# EAGLE design input_stage (EAGLE 7.6.0)
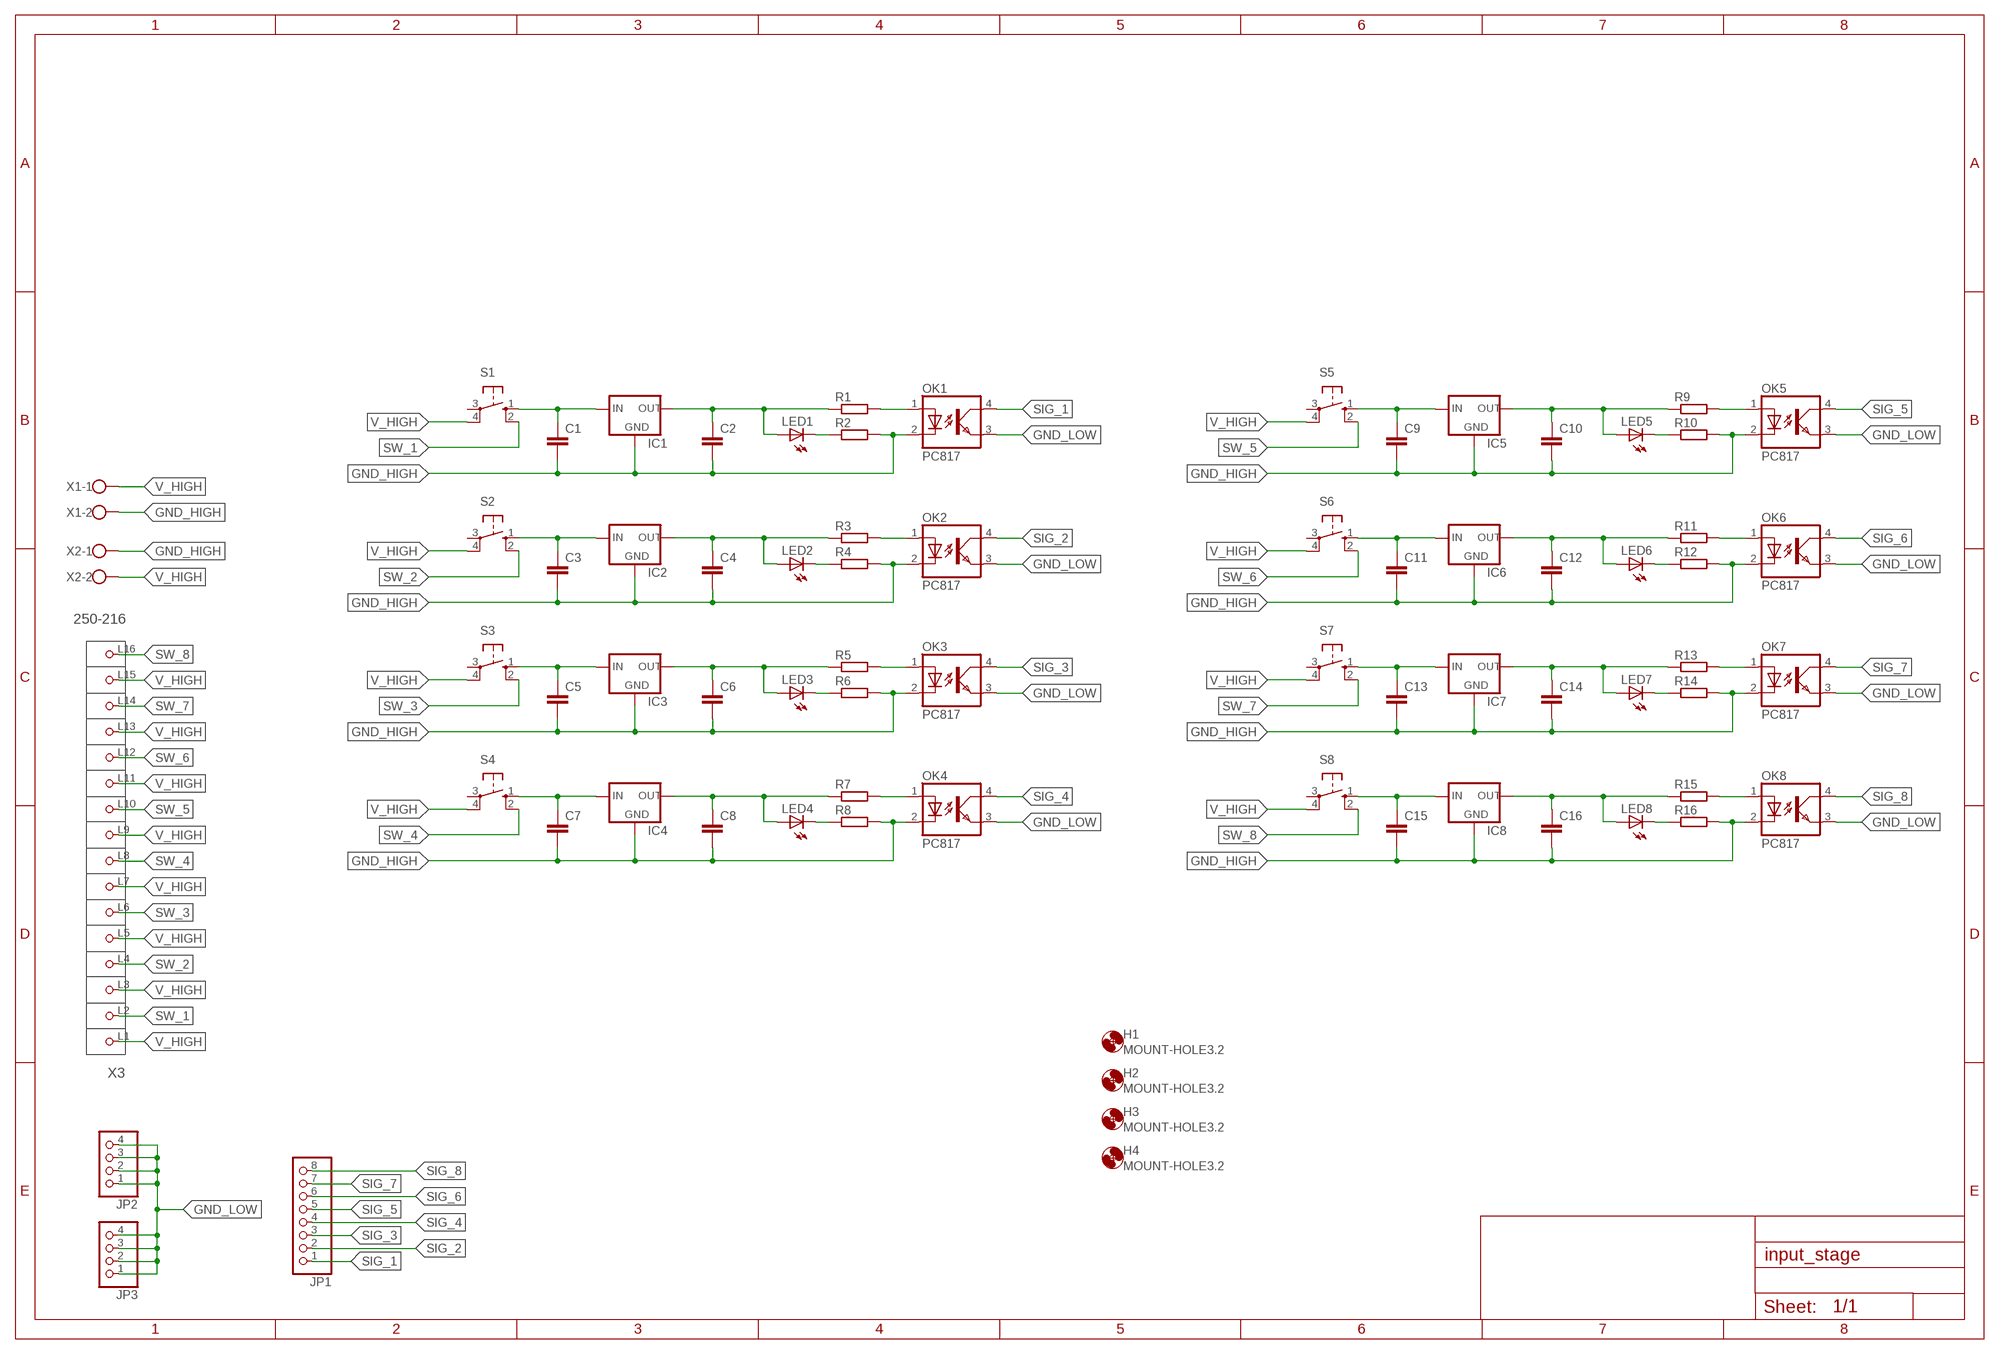
[diagram p0: schematic, sheet 1]

## Parts
C1  C-EU050-024X044  [C050-024X044]
C2  C-EU050-024X044  [C050-024X044]
C3  C-EU050-024X044  [C050-024X044]
C4  C-EU050-024X044  [C050-024X044]
C5  C-EU050-024X044  [C050-024X044]
C6  C-EU050-024X044  [C050-024X044]
C7  C-EU050-024X044  [C050-024X044]
C8  C-EU050-024X044  [C050-024X044]
C9  C-EU050-024X044  [C050-024X044]
C10  C-EU050-024X044  [C050-024X044]
C11  C-EU050-024X044  [C050-024X044]
C12  C-EU050-024X044  [C050-024X044]
C13  C-EU050-024X044  [C050-024X044]
C14  C-EU050-024X044  [C050-024X044]
C15  C-EU050-024X044  [C050-024X044]
C16  C-EU050-024X044  [C050-024X044]
H1  MOUNT-HOLE3.2  [3,2]
H2  MOUNT-HOLE3.2  [3,2]
H3  MOUNT-HOLE3.2  [3,2]
H4  MOUNT-HOLE3.2  [3,2]
IC1  78LXX  [78LXX]
IC2  78LXX  [78LXX]
IC3  78LXX  [78LXX]
IC4  78LXX  [78LXX]
IC5  78LXX  [78LXX]
IC6  78LXX  [78LXX]
IC7  78LXX  [78LXX]
IC8  78LXX  [78LXX]
JP1  PINHD-1X8  [1X08]
JP2  PINHD-1X4  [1X04]
JP3  PINHD-1X4  [1X04]
LED1  LED3MM  [LED3MM]
LED2  LED3MM  [LED3MM]
LED3  LED3MM  [LED3MM]
LED4  LED3MM  [LED3MM]
LED5  LED3MM  [LED3MM]
LED6  LED3MM  [LED3MM]
LED7  LED3MM  [LED3MM]
LED8  LED3MM  [LED3MM]
OK1  PC817  [DIL04]
OK2  PC817  [DIL04]
OK3  PC817  [DIL04]
OK4  PC817  [DIL04]
OK5  PC817  [DIL04]
OK6  PC817  [DIL04]
OK7  PC817  [DIL04]
OK8  PC817  [DIL04]
R1  R-EU_0207/10  [0207/10]
R2  R-EU_0207/10  [0207/10]
R3  R-EU_0207/10  [0207/10]
R4  R-EU_0207/10  [0207/10]
R5  R-EU_0207/10  [0207/10]
R6  R-EU_0207/10  [0207/10]
R7  R-EU_0207/10  [0207/10]
R8  R-EU_0207/10  [0207/10]
R9  R-EU_0207/10  [0207/10]
R10  R-EU_0207/10  [0207/10]
R11  R-EU_0207/10  [0207/10]
R12  R-EU_0207/10  [0207/10]
R13  R-EU_0207/10  [0207/10]
R14  R-EU_0207/10  [0207/10]
R15  R-EU_0207/10  [0207/10]
R16  R-EU_0207/10  [0207/10]
S1  10-XX  [B3F-10XX]
S2  10-XX  [B3F-10XX]
S3  10-XX  [B3F-10XX]
S4  10-XX  [B3F-10XX]
S5  10-XX  [B3F-10XX]
S6  10-XX  [B3F-10XX]
S7  10-XX  [B3F-10XX]
S8  10-XX  [B3F-10XX]
X1  W237-102  [W237-102]
X2  W237-102  [W237-102]
X3  250-216  [P-250-216]

## Nets
GND_HIGH: C1.2 C2.2 C3.2 C4.2 C5.2 C6.2 C7.2 C8.2 C9.2 C10.2 C11.2 C12.2 C13.2 C14.2 C15.2 C16.2 IC1.GND IC2.GND IC3.GND IC4.GND IC5.GND IC6.GND IC7.GND IC8.GND OK1.2(C) OK2.2(C) OK3.2(C) OK4.2(C) OK5.2(C) OK6.2(C) OK7.2(C) OK8.2(C) R2.2 R4.2 R6.2 R8.2 R10.2 R12.2 R14.2 R16.2 X1.2 X2.1
GND_LOW: JP2.1 JP2.2 JP2.3 JP2.4 JP3.1 JP3.2 JP3.3 JP3.4 OK1.3(EMIT) OK2.3(EMIT) OK3.3(EMIT) OK4.3(EMIT) OK5.3(EMIT) OK6.3(EMIT) OK7.3(EMIT) OK8.3(EMIT)
N$1: OK1.1(A) R1.2
N$2: C2.1 IC1.OUT LED1.A R1.1
N$3: C1.1 IC1.IN S1.1(S)
N$4: LED1.K(C) R2.1
N$5: OK4.1(A) R7.2
N$6: OK2.1(A) R3.2
N$7: C8.1 IC4.OUT LED4.A R7.1
N$8: LED4.K(C) R8.1
N$9: OK5.1(A) R9.2
N$10: C10.1 IC5.OUT LED5.A R9.1
N$11: LED5.K(C) R10.1
N$12: OK6.1(A) R11.2
N$13: C3.1 IC2.IN S2.1(S)
N$14: C12.1 IC6.OUT LED6.A R11.1
N$15: C5.1 IC3.IN S3.1(S)
N$16: LED6.K(C) R12.1
N$17: C7.1 IC4.IN S4.1(S)
N$18: OK7.1(A) R13.2
N$19: C15.1 IC8.IN S8.1(S)
N$20: C4.1 IC2.OUT LED2.A R3.1
N$21: LED2.K(C) R4.1
N$22: C14.1 IC7.OUT LED7.A R13.1
N$23: OK3.1(A) R5.2
N$24: C6.1 IC3.OUT LED3.A R5.1
N$25: LED3.K(C) R6.1
N$26: LED7.K(C) R14.1
N$27: OK8.1(A) R15.2
N$28: C16.1 IC8.OUT LED8.A R15.1
N$29: LED8.K(C) R16.1
N$30: C13.1 IC7.IN S7.1(S)
N$31: C11.1 IC6.IN S6.1(S)
N$32: C9.1 IC5.IN S5.1(S)
SIG_1: JP1.1 OK1.4(COL)
SIG_2: JP1.2 OK2.4(COL)
SIG_3: JP1.3 OK3.4(COL)
SIG_4: JP1.4 OK4.4(COL)
SIG_5: JP1.5 OK5.4(COL)
SIG_6: JP1.6 OK6.4(COL)
SIG_7: JP1.7 OK7.4(COL)
SIG_8: JP1.8 OK8.4(COL)
SW_1: S1.2(S1) X3.L2(P2)
SW_2: S2.2(S1) X3.L4(P4)
SW_3: S3.2(S1) X3.L6(P6)
SW_4: S4.2(S1) X3.L8(P8)
SW_5: S5.2(S1) X3.L10(P10)
SW_6: S6.2(S1) X3.L12(P12)
SW_7: S7.2(S1) X3.L14(P14)
SW_8: S8.2(S1) X3.L16(P16)
V_HIGH: S1.4(P1) S2.4(P1) S3.4(P1) S4.4(P1) S5.4(P1) S6.4(P1) S7.4(P1) S8.4(P1) X1.1 X2.2 X3.L1(P1) X3.L3(P3) X3.L5(P5) X3.L7(P7) X3.L9(P9) X3.L11(P11) X3.L13(P13) X3.L15(P15)
Unconnected: S1.3(P) S2.3(P) S3.3(P) S4.3(P) S5.3(P) S6.3(P) S7.3(P) S8.3(P)

## Library data of the parts
C1-C16 = resistor:C-EU: CAPACITOR, European symbol
H1-H4 = holes:MOUNT-HOLE: MOUNTING HOLE with drill center marker
IC1-IC8 = v-reg:78LXX: VOLTAGE REGULATOR
JP1 = pinhead:PINHD-1X8: PIN HEADER
JP2 JP3 = pinhead:PINHD-1X4: PIN HEADER
LED1-LED8 = led:LED: LED OSRAM: - CHIPLED LG R971, LG N971, LY N971, LG Q971, LY Q971, LO R971, LY R971 LH N974, LH R974 LS Q976, LO Q976, LY Q976 LO Q996 - Hyper CHIPLED LW Q18S LB Q993, LB Q99A, LB R99A - SideLED LS A670, LO A670, LY A670, LG A670, LP A670 LB A673, LV A673, LT A673, LW A673 LH A674 LY A675 LS A676, LA A676, LO A676, LY A676, LW A676 LS A679, LY A679, LG A679 - Hyper Micro SIDELED® LS Y876, LA Y876, LO Y876, LY Y876 LT Y87S - SmartLED LW L88C, LW L88S LB L89C, LB L89S, LG L890 LS L89K, LO L89K, LY L89K LS L896, LA L896, LO L896, LY L896 - TOPLED LS T670, LO T670, LY T670, LG T670, LP T670 LSG T670, LSP T670, LSY T670, LOP T670, LYG T670 LG T671, LOG T671, LSG T671 LB T673, LV T673, LT T673, LW T673 LH T674 LS T676, LA T676, LO T676, LY T676, LB T676, LH T676, LSB T676, LW T676 LB T67C, LV T67C, LT T67C, LS T67K, LO T67K, LY T67K, LW E67C LS E67B, LA E67B, LO E67B, LY E67B, LB E67C, LV E67C, LT E67C LW T67C LS T679, LY T679, LG T679 LS T770, LO T770, LY T770, LG T770, LP T770 LB T773, LV T773, LT T773, LW T773 LH T774 LS E675, LA E675, LY E675, LS T675 LS T776, LA T776, LO T776, LY T776, LB T776 LHGB T686 LT T68C, LB T68C - Hyper Mini TOPLED® LB M676 - Mini TOPLED Santana® LG M470 LS M47K, LO M47K, LY M47K Source: http://www.osram.convergy.de LUXEON: - LUMILED® LXK2-PW12-R00, LXK2-PW12-S00, LXK2-PW14-U00, LXK2-PW14-V00 LXK2-PM12-R00, LXK2-PM12-S00, LXK2-PM14-U00 LXK2-PE12-Q00, LXK2-PE12-R00, LXK2-PE12-S00, LXK2-PE14-T00, LXK2-PE14-U00 LXK2-PB12-K00, LXK2-PB12-L00, LXK2-PB12-M00, LXK2-PB14-N00, LXK2-PB14-P00, LXK2-PB14-Q00 LXK2-PR12-L00, LXK2-PR12-M00, LXK2-PR14-Q00, LXK2-PR14-R00 LXK2-PD12-Q00, LXK2-PD12-R00, LXK2-PD12-S00 LXK2-PH12-R00, LXK2-PH12-S00 LXK2-PL12-P00, LXK2-PL12-Q00, LXK2-PL12-R00 Source: www.luxeon.com KINGBRIGHT: KA-3528ASYC Source: www.kingbright.com
OK1-OK8 = optocoupler:PC817: SHARP OPTO COUPLER; MPN: PC817X4J000F; OC_FARNELL: 9707727; OC_NEWARK: 97K7059
R1-R16 = resistor:R-EU_: RESISTOR, European symbol
S1-S8 = switch-omron:10-XX: OMRON SWITCH; MPN: B3F-1000; OC_FARNELL: 176432; OC_NEWARK: 36M3542
X1 X2 = con-wago-500:W237-102: WAGO SCREW CLAMP; MPN: 237-102; OC_FARNELL: unknown; OC_NEWARK: 70K9898
X3 = con-wago_250:250-216: Serie 250, 1-Leiter-Klemmenleiste für Leiterplatten 1 Lötstift/Pol versetzt / Series 250, 1-conductor PCB terminal strip 1 solder pin/pole, staggered Polzahl / Pole No.: 16 Rastermaß / Pitch: 3.5 - 3.5 mm Bemessungsspannung / Rated Voltage: 320 V Nennstrom / Nominal Current: 8 A Leiterquerschnitt / Conductor Size: 0.2 - 1.5 mm2 Anschlusstechnik / Connection Technology: CAGE CLAMP® S Lötstiftlänge: / Solder Pin Length: 3.6 mm Leitereinführung (zur Platine) / Conductor entry angle (to PCB): 45 ° Farbe / Color: grau / gray Stand: 01.01.2014. Die jeweils aktuellen Daten zu diesem Artikel finden Sie in unserem Produktkatalog, den Sie unter www.wago.com einsehen können. As of: 01/01/2014. Please find the newest data for this article in our product catalogue, which can be viewed under www.wago.com.

## Board
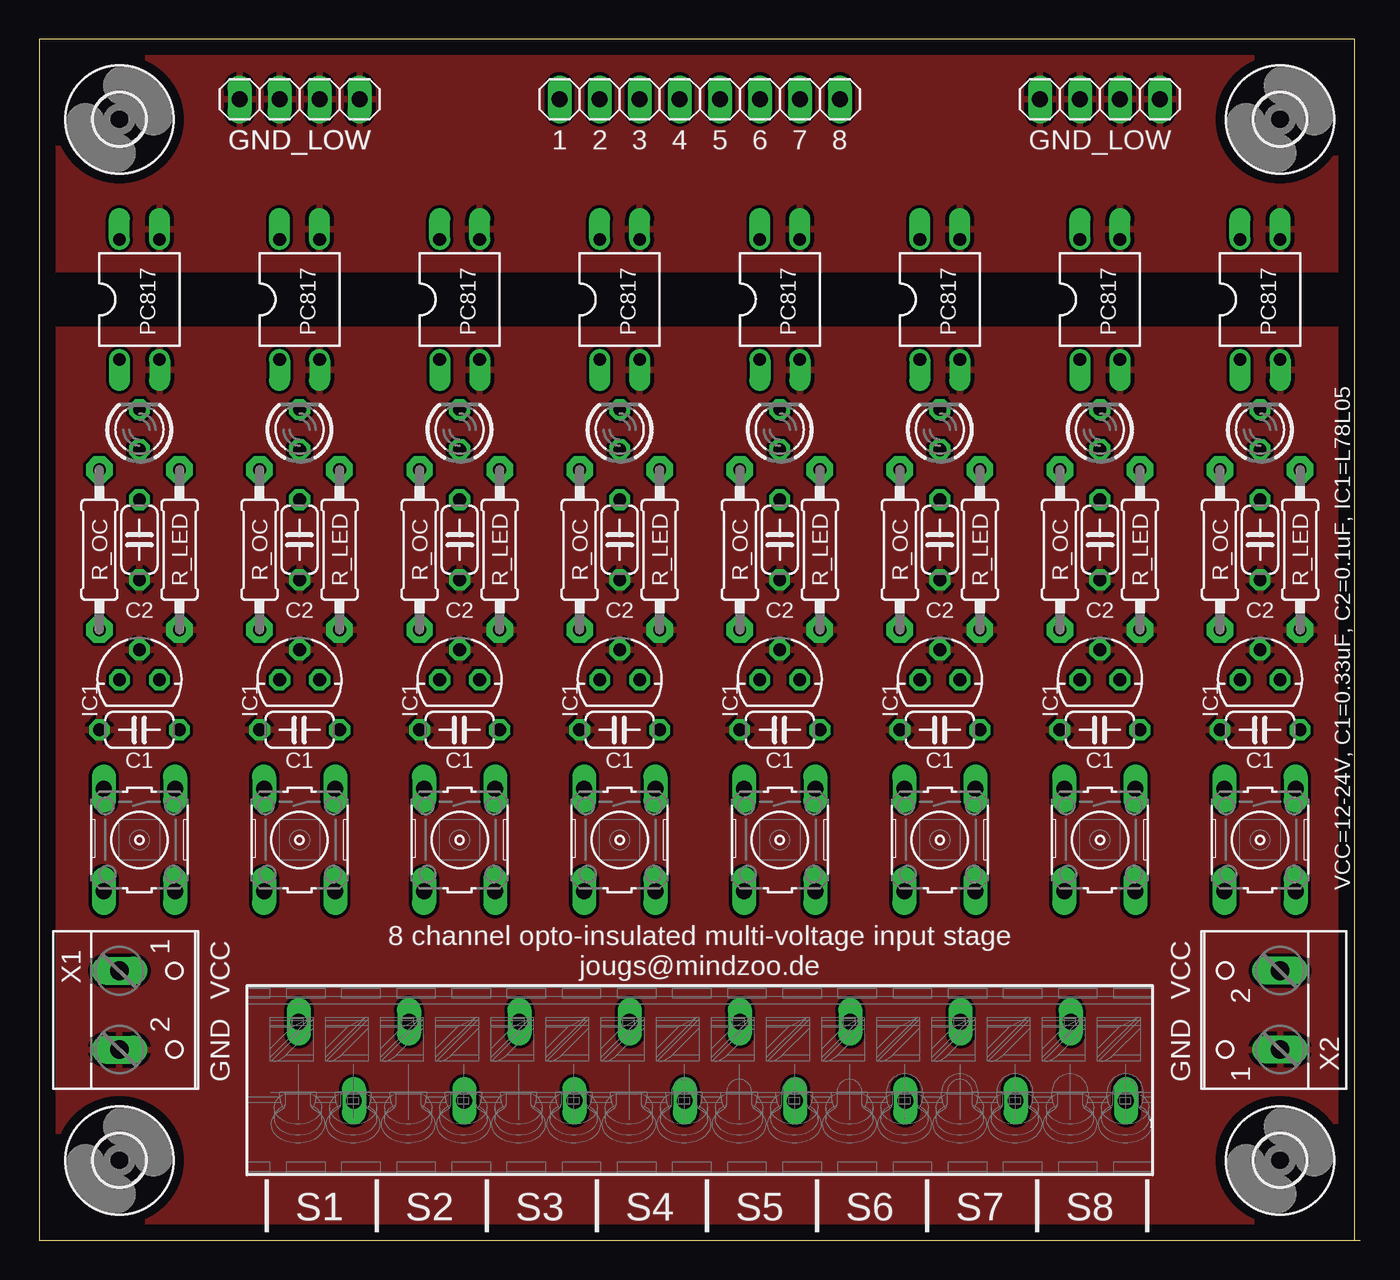
[diagram p1: board, top side]
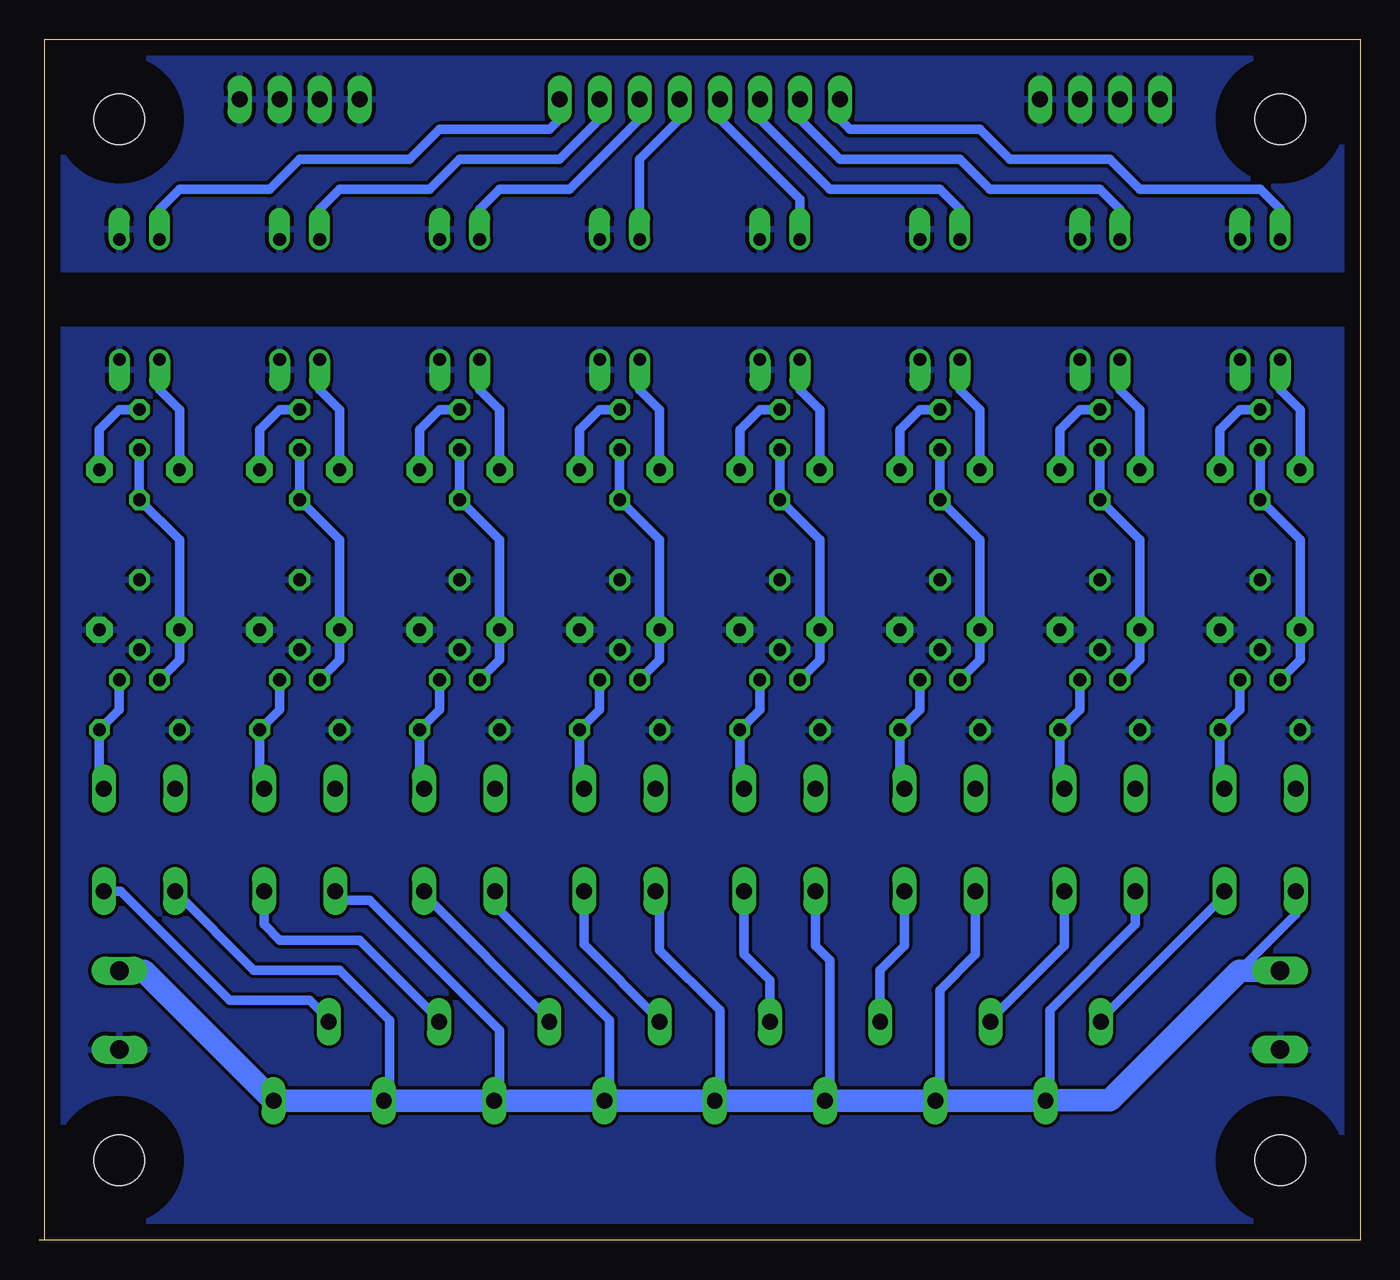
[diagram p2: board, bottom side, seen from below]

Size 83.82 x 76.19 mm. Coordinates in mm from the lower left corner, seen from the top.
Outline: 83.49,0 83.49,76.19 0,76.19 0,0 83.82,0
Copper layers (1*16): Top 0.035mm / dielectric 1.5mm / Bottom 0.035mm
Design rules "default": minimum track width 10mil, minimum drill 24mil, track to track 8mil, track to pad 8mil, pad to pad 8mil, via to via 8mil, smd to smd 8mil, copper to edge 40mil, drill to drill 8mil, minimum pad ring 10mil, minimum via ring 8mil, stop-mask expansion 4mil, vias tented up to drill 0mil, thermal gap 10mil

### Footprints (pad centres in the part's own frame; a part is rotated, then mirrored left to right if it is on the bottom)
C050-024X044 = drill 0.813 octagon: 1 -2.54,0; 2 2.54,0
3,2 = hole 3.2: 0,0
78LXX = drill 0.813 octagon: GND 0,1.905; IN 1.27,0; OUT -1.27,0
1X08 = drill 1.016 long: 1 -8.89,0; 2 -6.35,0; 3 -3.81,0; 4 -1.27,0; 5 1.27,0; 6 3.81,0; 7 6.35,0; 8 8.89,0
1X04 = drill 1.016 long: 1 -3.81,0; 2 -1.27,0; 3 1.27,0; 4 3.81,0
LED3MM = drill 0.813 octagon: A -1.27,0; K 1.27,0
DIL04 = drill 0.813 offset: 1 -1.27,-3.81; 2 1.27,-3.81; 3 1.27,3.81; 4 -1.27,3.81
0207/10 = drill 0.813 pad 1.676 octagon: 1 -5.08,0; 2 5.08,0
B3F-10XX = drill 1.016 long: 1 -3.251,2.261; 2 3.251,2.261; 3 -3.251,-2.261; 4 3.251,-2.261
W237-102 = drill 1.194 long: 1 -2.5,-1.27; 2 2.5,-1.27
P-250-216 = drill 1 long: L1 1.3,27.05; L2 -3.7,23.55; L3 1.3,20.05; L4 -3.7,16.55; L5 1.3,13.05; L6 -3.7,9.55; L7 1.3,6.05; L8 -3.7,2.55; L9 1.3,-0.95; L10 -3.7,-4.45; L11 1.3,-7.95; L12 -3.7,-11.45; L13 1.3,-14.95; L14 -3.7,-18.45; L15 1.3,-21.95; L16 -3.7,-25.45

### Placement (x,y rotation side)
C1  77.47,32.38 180 top
C2  77.47,44.45 270 top
C3  67.31,32.38 180 top
C4  67.31,44.45 270 top
C5  57.15,32.38 180 top
C6  57.15,44.45 270 top
C7  46.99,32.38 180 top
C8  46.99,44.45 270 top
C9  36.83,32.38 180 top
C10  36.83,44.45 270 top
C11  26.67,32.38 180 top
C12  26.67,44.45 270 top
C13  16.51,32.38 180 top
C14  16.51,44.45 270 top
C15  6.35,32.38 180 top
C16  6.35,44.45 270 top
H1  78.74,71.12 0 top
H2  5.08,71.12 0 top
H3  78.74,5.08 0 top
H4  5.08,5.08 0 top
IC1  77.47,35.56 0 top
IC2  67.31,35.56 0 top
IC3  57.15,35.56 0 top
IC4  46.99,35.56 0 top
IC5  36.83,35.56 0 top
IC6  26.67,35.56 0 top
IC7  16.51,35.56 0 top
IC8  6.35,35.56 0 top
JP1  41.91,72.39 180 top
JP2  67.31,72.39 180 top
JP3  16.51,72.39 180 top
LED1  77.47,51.44 90 top
LED2  67.31,51.44 90 top
LED3  57.15,51.44 90 top
LED4  46.99,51.44 90 top
LED5  36.83,51.44 90 top
LED6  26.67,51.44 90 top
LED7  16.51,51.44 90 top
LED8  6.35,51.44 90 top
OK1  77.47,59.69 0 top
OK2  67.31,59.69 0 top
OK3  57.15,59.69 0 top
OK4  46.99,59.69 0 top
OK5  36.83,59.69 0 top
OK6  26.67,59.69 0 top
OK7  16.51,59.69 0 top
OK8  6.35,59.69 0 top
R1  74.93,43.81 90 top
R2  80.01,43.81 270 top
R3  64.77,43.81 90 top
R4  69.85,43.81 270 top
R5  54.61,43.81 90 top
R6  59.69,43.81 270 top
R7  44.45,43.81 90 top
R8  49.53,43.81 270 top
R9  34.29,43.81 90 top
R10  39.37,43.81 270 top
R11  24.13,43.81 90 top
R12  29.21,43.81 270 top
R13  13.97,43.81 90 top
R14  19.05,43.81 270 top
R15  3.81,43.81 90 top
R16  8.89,43.81 270 top
S1  77.47,25.4 270 top
S2  67.31,25.4 270 top
S3  57.15,25.4 270 top
S4  46.99,25.4 270 top
S5  36.83,25.4 270 top
S6  26.67,25.4 270 top
S7  16.51,25.4 270 top
S8  6.35,25.4 270 top
X1  6.35,14.61 270 top
X2  77.47,14.61 90 top
X3  41.91,10.16 270 top

### Tracks (layer width: path | path; a pad name or v marks a point on that pad's centre or on a via)
GND_HIGH
  pour Bottom: -3.81,57.78 86.36,57.78 86.36,0 -3.81,0
  pour Top: -1.27,57.78 87.63,57.78 87.63,-3.81 -2.54,-3.81 -2.54,58.42
GND_LOW
  pour Bottom: 86.36,61.59 -3.81,61.59 -3.81,77.47 86.36,77.47
  pour Top: -1.27,78.74 -1.27,61.59 86.36,61.59 86.36,78.74
N$1
  Bottom 0.61: OK1.1 76.2,53.98 74.93,52.7 R1.2
N$2
  Bottom 0.61: IC1.OUT 74.93,36.83 R1.1 74.93,44.45 C2.1 LED1.A
N$3
  Bottom 0.61: IC1.IN 78.74,33.66 C1.1 80.01,28.93 S1.1
N$4
  Bottom 0.61: LED1.K 78.74,52.7 80.01,51.44 R2.1
N$5
  Bottom 0.61: OK4.1 45.72,53.98 44.45,52.7 R7.2
N$6
  Bottom 0.61: OK2.1 66.04,53.98 64.77,52.7 R3.2
N$7
  Bottom 0.61: IC4.OUT 44.45,36.83 R7.1 44.45,44.45 C8.1 LED4.A
N$8
  Bottom 0.61: LED4.K 48.26,52.7 49.53,51.44 R8.1
N$9
  Bottom 0.61: OK5.1 35.56,53.98 34.29,52.7 R9.2
N$10
  Bottom 0.61: IC5.OUT 34.29,36.83 R9.1 34.29,44.45 C10.1 LED5.A
N$11
  Bottom 0.61: LED5.K 38.1,52.7 39.37,51.44 R10.1
N$12
  Bottom 0.61: OK6.1 25.4,53.98 24.13,52.7 R11.2
N$13
  Bottom 0.61: IC2.IN 68.58,33.66 C3.1 69.85,28.93 S2.1
N$14
  Bottom 0.61: IC6.OUT 24.13,36.83 R11.1 24.13,44.45 C12.1 LED6.A
N$15
  Bottom 0.61: IC3.IN 58.42,33.66 C5.1 59.69,28.93 S3.1
N$16
  Bottom 0.61: LED6.K 27.94,52.7 29.21,51.44 R12.1
N$17
  Bottom 0.61: IC4.IN 48.26,33.66 C7.1 49.53,28.93 S4.1
N$18
  Bottom 0.61: OK7.1 15.24,53.98 13.97,52.7 R13.2
N$19
  Bottom 0.61: IC8.IN 7.62,33.66 C15.1 8.89,28.93 S8.1
N$20
  Bottom 0.61: IC2.OUT 64.77,36.83 R3.1 64.77,44.45 C4.1 LED2.A
N$21
  Bottom 0.61: LED2.K 68.58,52.7 69.85,51.44 R4.1
N$22
  Bottom 0.61: IC7.OUT 13.97,36.83 R13.1 13.97,44.45 C14.1 LED7.A
N$23
  Bottom 0.61: OK3.1 55.88,53.98 54.61,52.7 R5.2
N$24
  Bottom 0.61: IC3.OUT 54.61,36.83 R5.1 54.61,44.45 C6.1 LED3.A
N$25
  Bottom 0.61: LED3.K 58.42,52.7 59.69,51.44 R6.1
N$26
  Bottom 0.61: LED7.K 17.78,52.7 19.05,51.44 R14.1
N$27
  Bottom 0.61: OK8.1 5.08,53.98 3.81,52.7 R15.2
N$28
  Bottom 0.61: IC8.OUT 3.81,36.83 R15.1 3.81,44.45 C16.1 LED8.A
N$29
  Bottom 0.61: LED8.K 7.62,52.7 8.89,51.44 R16.1
N$30
  Bottom 0.61: IC7.IN 17.78,33.66 C13.1 19.05,28.93 S7.1
N$31
  Bottom 0.61: IC6.IN 27.94,33.66 C11.1 29.21,28.93 S6.1
N$32
  Bottom 0.61: IC5.IN 38.1,33.66 C9.1 39.37,28.93 S5.1
SIG_1
  Bottom 0.61: JP1.1 50.8,71.12 51.44,70.48 58.42,70.48 60.33,68.58 67.31,68.58 69.22,66.67 74.93,66.67 76.2,65.41 OK1.4
SIG_2
  Bottom 0.61: JP1.2 48.26,71.12 50.8,68.58 57.15,68.58 59.05,66.67 64.77,66.67 66.04,65.41 OK2.4
SIG_3
  Bottom 0.61: JP1.3 45.72,71.12 50.16,66.67 54.61,66.67 55.88,65.41 OK3.4
SIG_4
  Bottom 0.61: JP1.4 43.18,71.12 45.72,68.58 OK4.4
SIG_5
  Bottom 0.61: JP1.5 40.64,71.12 35.56,66.04 OK5.4
SIG_6
  Bottom 0.61: JP1.6 38.1,71.12 33.66,66.67 26.67,66.67 25.4,65.41 OK6.4
SIG_7
  Bottom 0.61: JP1.7 35.56,71.12 33.02,68.58 25.4,68.58 23.5,66.67 16.51,66.67 15.24,65.41 OK7.4
SIG_8
  Bottom 0.61: JP1.8 33.02,71.12 32.38,70.48 24.13,70.48 22.23,68.58 15.88,68.58 13.97,66.67 6.35,66.67 5.08,65.41 OK8.4
SW_1
  Bottom 0.61: X3.L2 65.41,13.91 65.41,13.97 66.67,15.24 71.75,15.24 78.66,22.15 S1.2
SW_2
  Bottom 0.61: S2.2 69.57,20.04 68.58,19.05 63.5,19.05 58.42,13.97 58.42,13.9 X3.L4
SW_3
  Bottom 0.61: S3.2 59.41,21.95 51.44,13.97 51.44,13.88 X3.L6
SW_4
  Bottom 0.61: S4.2 49.25,18.77 44.45,13.97 X3.L8
SW_5
  Bottom 0.61: S5.2 39.09,18.14 37.47,16.51 X3.L10
SW_6
  Bottom 0.61: S6.2 28.93,18.69 30.48,17.14 30.48,13.88 X3.L12
SW_7
  Bottom 0.61: S7.2 18.77,18.69 23.5,13.97 23.5,13.89 X3.L14
SW_8
  Bottom 0.61: S8.2 8.61,21.87 16.51,13.97 16.51,13.91 X3.L16
V_HIGH
  Bottom 0.61: X3.L15 19.68,9.13 19.68,14.61 14.25,20.04 S7.4 | X3.L9 40.64,9.18 40.64,14.61 44.45,18.41 44.45,21.87 S4.4 | X3.L5 54.61,9.21 54.61,13.34 62.87,21.59 64.49,21.59 S2.4 | X3.L3 61.59,9.22 61.59,13.97 64.77,17.14 70.21,17.14 S1.4 | S6.4 24.41,18.14 26.67,15.88 26.67,9.15 X3.L13 | S5.4 34.57,18.69 33.66,17.78 33.66,9.16 X3.L11 | S3.4 54.89,21.23 47.62,13.97 47.62,9.2 X3.L7 | S8.4 4.09,20.68 7.94,16.83
  Bottom 1.422: X1.1 7.66,17.11 7.94,16.83 15.88,8.89 19.93,8.89 X3.L15 X3.L13 X3.L11 X3.L9 X3.L7 X3.L5 X3.L3 X3.L1 77.2,17.11 X2.2

### Text on the board
tNames: GND_LOW | GND_LOW | 1 | 2 | 3 | 4 | 5 | 6 | 7 | 8 | GND_LOW | R_OC | R_LED | R_OC | R_LED | R_OC | R_LED | R_OC | R_LED | R_OC | R_LED | R_OC | R_LED | R_OC | R_LED | R_OC | R_LED | C2 | C2 | C2 | C2 | C2 | C2 | C2 | C2 | IC1 | IC1 | IC1 | IC1 | IC1 | IC1 | IC1 | IC1 | C1 | C1 | C1 | C1 | C1 | C1 | C1 | C1 | VCC=12-24V, C1=0.33uF, C2=0.1uF, IC1=L78L05 | 8 channel opto-insulated multi-voltage input stage / jougs@mindzoo.de | VCC | VCC | GND | GND | | | S1 | | | S2 | | | S3 | | | S4 | | | S5 | | | S6 | | | S7 | | | S8 | |